# Altium schematic sheet circuit_on_off.SchDoc: Power Control Board
size A; CheckedBy: TunBra; DrawnBy: Iheb Wesleti; SheetNumber: 2; SheetTotal: 3
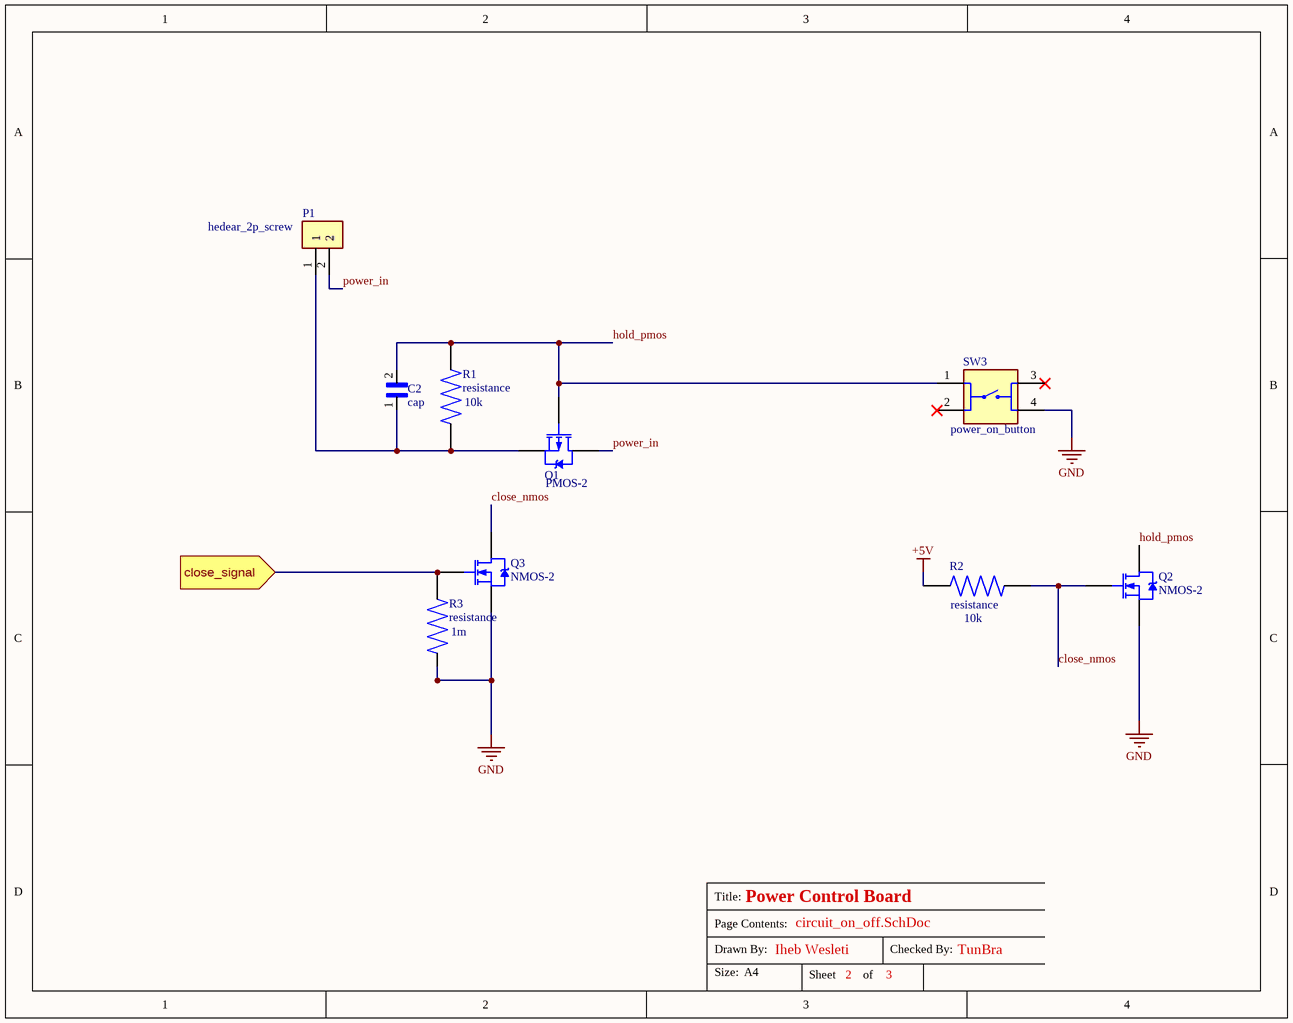
[diagram p0: circuit_on_off.SchDoc]

## Parts
C2  cap  [cap]
P1  hedear_2p_screw  [hedear_2p_screw]
Q1  PMOS-2  [TO-220AB]
Q2  NMOS-2  [TO-220AB]
Q3  NMOS-2  [TO-220AB]
R1  resistance  value 10k  [resistance]
R2  resistance  value 10k  [resistance]
R3  resistance  value 1m  [resistance]
SW3  power_on_button  [push_button_pcb]

## Ports
close_signal (in)

## Nets
+5V: R2.2
GND: Q2.3(S) Q3.3(S) R3.2 SW3.4
close_nmos: Q2.1(G) Q3.2(D) R2.1
close_signal: Q3.1(G) R3.1 ; port close_signal
hold_pmos: C2.2 Q1.1(G) Q2.2(D) R1.2 SW3.1
power_in: P1.2 Q1.2(D)
NetC2_1: C2.1 P1.1 Q1.3(S) R1.1

Not connected (* = marked no-connect by the designer): SW3 2* 3*

## Notes on the sheet
- Title:
- Size:
- Drawn By:
- Page Contents:
- A4
- Sheet
- of
- Checked By:
- 3

## Library data of the parts
C2 = cap: Lead Capacitor X7R_EIA_ with Capacitance: 0.10F and Rated Voltage: 1000Vdc; MF: Murata; MP: RDER73A104K5E1H03A; Value: *; Price: None; SnapEDA_Link: https://www.snapeda.com/parts/RDER73A104K5E1H03A/Murata/view-part/4545952/?ref=snap; Package: Radial Murata; Availability: Unavailable
P1 = hedear_2p_screw: MF: TE Connectivity; MP: 282837-2; SnapEDA_Link: https://www.snapeda.com/parts/282837-2/TE+Connectivity+AMP+Connectors/view-part/?ref=snap; Price: None; Check_prices: https://www.snapeda.com/parts/282837-2/TE+Connectivity+AMP+Connectors/view-part/?ref=eda; Purchase-URL: https://pricing.snapeda.com/search/part/282837-2/?ref=eda; Value: *; Availability: In Stock; Package: None
Q1 = PMOS-2: P-Channel Power MOSFET; Note: Pin 4 not drawn and electrically connected to Pin 2.; Published: 8-Jun-2000; LatestRevisionDate: 17-Jul-2002; LatestRevisionNote: Re-released for DXP Platform.; DatasheetVersion: PD-9.390D; PackageVersion: Feb-1997; PackageReference: TO-220AB; Publisher: Altium Limited; PackageDescription: TO, Thru-Hole, Vertical, Heatsink Mounted; 3 In-Line Leads; Pitch 2.54 mm; ComponentLink1Description: Manufacturer Link; ComponentLink1URL: http://www.irf.com/
Q2 Q3 = NMOS-2: N-Channel Power MOSFET; Note: Pin 2 is electrically connected to pin 4.; Published: 8-Jun-2000; LatestRevisionDate: 17-Jul-2002; LatestRevisionNote: Re-released for DXP Platform.; DatasheetVersion: PD-9.814; PackageVersion: Feb-1997; PackageReference: TO-220AB; Publisher: Altium Limited; PackageDescription: TO, Thru-Hole, Vertical, Heatsink Mounted; 3 In-Line Leads; Pitch 2.54 mm; ComponentLink1Description: Manufacturer Link; ComponentLink1URL: http://www.irf.com/
R1-R3 = resistance: MP: CBT50J5R1; MF: TE Connectivity / AMP; Price: None; Availability: In Stock; Package: Axial TE Connectivity / AMP; SnapEDA_Link: https://www.snapeda.com/parts/CBT50J5R1/TE+Connectivity+%252F+AMP/view-part/?ref=snap; Purchase-URL: https://pricing.snapeda.com/search/part/CBT50J5R1/?ref=eda; Check_prices: https://www.snapeda.com/parts/CBT50J5R1/TE+Connectivity+%252F+AMP/view-part/?ref=eda
SW3 = push_button: Switch Push Button OFF (ON) SPST Round Button 0.05A 24VDC Momentary Contact PC Pins Thru-Hole; MP: 1825910-6; MF: TE Connectivity; Value: *; Package: None; Check_prices: https://www.snapeda.com/parts/1825910-6/TE+Connectivity+ALCOSWITCH+Switches/view-part/?ref=eda; SnapEDA_Link: https://www.snapeda.com/parts/1825910-6/TE+Connectivity+ALCOSWITCH+Switches/view-part/?ref=snap; Digi-Key_Part_Number: 450-1650-ND; Purchase-URL: https://pricing.snapeda.com/search/part/1825910-6/?ref=eda